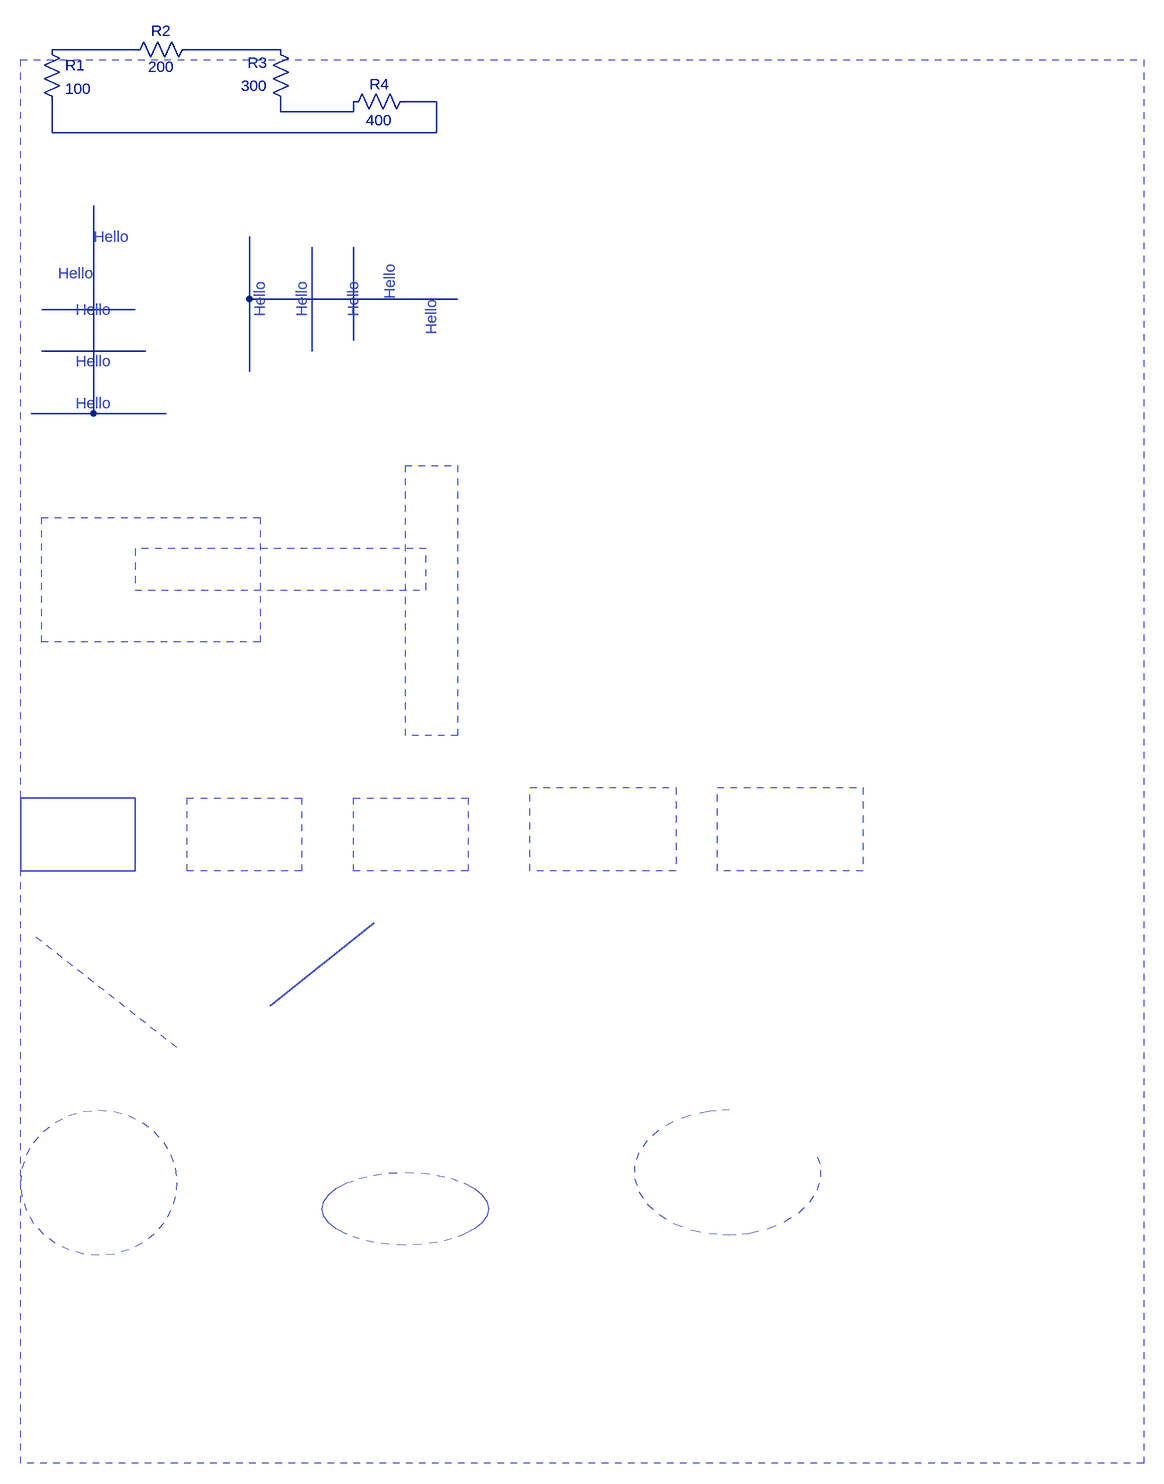
[diagram p0: schematic 08- Text rectangle and bounding box.asc]
08- Text rectangle and bounding box.asc, the LTspice schematic file:
Version 4.1
SHEET 1 1780 2308
WIRE 224 128 96 128
WIRE 448 128 304 128
WIRE 688 208 640 208
WIRE 448 224 448 208
WIRE 560 224 560 208
WIRE 560 224 448 224
WIRE 96 256 96 208
WIRE 688 256 688 208
WIRE 688 256 96 256
WIRE 400 512 400 416
WIRE 720 512 400 512
WIRE 224 528 80 528
WIRE 560 576 560 432
WIRE 240 592 80 592
WIRE 496 592 496 432
WIRE 400 624 400 512
WIRE 160 688 160 368
WIRE 160 688 64 688
WIRE 272 688 160 688
SYMBOL res 80 112 R0
SYMATTR InstName R1
SYMATTR Value 100
SYMBOL res 320 112 R90
WINDOW 0 3 56 VBottom 2
WINDOW 3 27 56 VTop 2
SYMATTR InstName R2
SYMATTR Value 200
SYMBOL res 464 224 R180
WINDOW 0 36 76 Left 2
WINDOW 3 36 40 Left 2
SYMATTR InstName R3
SYMATTR Value 300
SYMBOL res 544 224 R270
WINDOW 0 27 56 VTop 2
WINDOW 3 3 56 VBottom 2
SYMATTR InstName R4
SYMATTR Value 400
TEXT 160 416 Left 2 ;Hello
TEXT 160 472 Right 2 ;Hello
TEXT 160 528 Center 2 ;Hello
TEXT 160 592 Top 2 ;Hello
TEXT 160 688 Bottom 2 ;Hello
TEXT 680 512 VRight 2 ;Hello
TEXT 616 512 VLeft 2 ;Hello
TEXT 560 512 VCenter 2 ;Hello
TEXT 496 512 VBottom 2 ;Hello
TEXT 400 512 VTop 2 ;Hello
LINE Normal 288 1664 64 1488 2
LINE Normal 592 1472 432 1600
RECTANGLE Normal 416 1040 80 848 2
RECTANGLE Normal 720 1184 640 768 2
RECTANGLE Normal 672 896 224 960 2
RECTANGLE Normal 224 1392 48 1280
RECTANGLE Normal 480 1392 304 1280 1
RECTANGLE Normal 736 1392 560 1280 2
RECTANGLE Normal 1056 1392 832 1264 3
RECTANGLE Normal 1344 1392 1120 1264 4
RECTANGLE Normal 1776 2304 48 144 2
CIRCLE Normal 288 1984 48 1760 2
CIRCLE Normal 768 1968 512 1856 2
ARC Normal 992 1760 1280 1952 1140 1645 1465 1776 2

The netlist it stands for:
* 08- Text rectangle and bounding box.asc
R1 N001 N003 100
R2 N002 N001 200
R3 N004 N002 300
R4 N004 N003 400
* Hello
* Hello
* Hello
* Hello
* Hello
* Hello
* Hello
* Hello
* Hello
* Hello
.backanno
.end